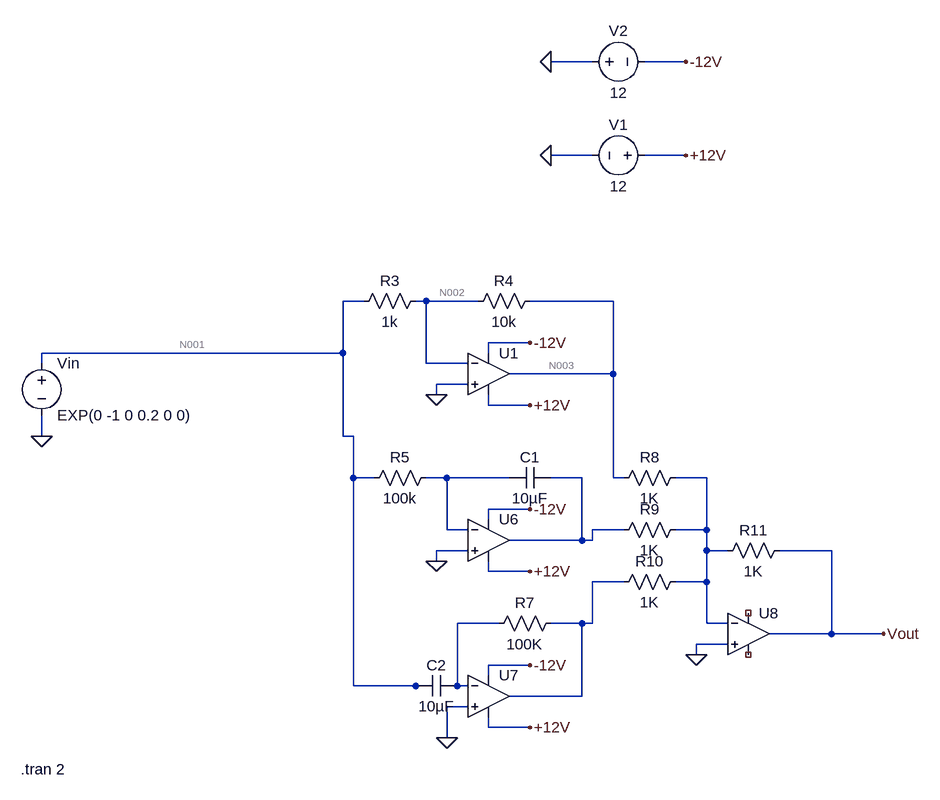
[diagram p0: schematic Draft6.asc]
Draft6.asc, the LTspice schematic file:
Version 4
SHEET 1 1112 704
WIRE 592 -400 528 -400
WIRE 736 -400 672 -400
WIRE 592 -256 528 -256
WIRE 736 -256 672 -256
WIRE 240 -32 208 -32
WIRE 336 -32 320 -32
WIRE 416 -32 336 -32
WIRE 624 -32 496 -32
WIRE 496 32 432 32
WIRE 208 48 208 -32
WIRE 208 48 -256 48
WIRE 432 48 432 32
WIRE -256 64 -256 48
WIRE 336 64 336 -32
WIRE 400 64 336 64
WIRE 624 80 624 -32
WIRE 624 80 464 80
WIRE 400 96 352 96
WIRE 352 112 352 96
WIRE 432 128 432 112
WIRE 496 128 432 128
WIRE -256 176 -256 144
WIRE 208 176 208 48
WIRE 224 176 208 176
WIRE 224 240 224 176
WIRE 256 240 224 240
WIRE 368 240 336 240
WIRE 464 240 368 240
WIRE 576 240 528 240
WIRE 624 240 624 80
WIRE 640 240 624 240
WIRE 768 240 720 240
WIRE 496 288 432 288
WIRE 432 304 432 288
WIRE 368 320 368 240
WIRE 400 320 368 320
WIRE 640 320 592 320
WIRE 768 320 768 240
WIRE 768 320 720 320
WIRE 576 336 576 240
WIRE 576 336 464 336
WIRE 592 336 592 320
WIRE 592 336 576 336
WIRE 400 352 352 352
WIRE 768 352 768 320
WIRE 800 352 768 352
WIRE 960 352 880 352
WIRE 352 368 352 352
WIRE 432 384 432 368
WIRE 496 384 432 384
WIRE 640 400 592 400
WIRE 768 400 768 352
WIRE 768 400 720 400
WIRE 448 464 384 464
WIRE 576 464 528 464
WIRE 592 464 592 400
WIRE 592 464 576 464
WIRE 768 464 768 400
WIRE 800 464 768 464
WIRE 960 480 960 352
WIRE 960 480 864 480
WIRE 1040 480 960 480
WIRE 800 496 752 496
WIRE 752 512 752 496
WIRE 496 528 432 528
WIRE 432 544 432 528
WIRE 224 560 224 240
WIRE 320 560 224 560
WIRE 336 560 320 560
WIRE 384 560 384 464
WIRE 400 560 384 560
WIRE 576 576 576 464
WIRE 576 576 464 576
WIRE 400 592 368 592
WIRE 432 624 432 608
WIRE 496 624 432 624
WIRE 368 640 368 592
FLAG 528 -256 0
FLAG 736 -256 +12V
FLAG 496 128 +12V
FLAG 496 384 +12V
FLAG 496 624 +12V
FLAG 496 32 -12V
FLAG 496 288 -12V
FLAG 496 528 -12V
FLAG 528 -400 0
FLAG 736 -400 -12V
FLAG 752 512 0
FLAG 352 368 0
FLAG 352 112 0
FLAG 368 640 0
FLAG -256 176 0
FLAG 1040 480 Vout
SYMBOL voltage 688 -256 R90
WINDOW 0 -32 56 VBottom 2
WINDOW 3 32 56 VTop 2
WINDOW 123 0 0 Left 0
WINDOW 39 0 0 Left 0
SYMATTR InstName V1
SYMATTR Value 12
SYMBOL voltage 576 -400 R270
WINDOW 0 32 56 VTop 2
WINDOW 3 -32 56 VBottom 2
WINDOW 123 0 0 Left 0
WINDOW 39 0 0 Left 0
SYMATTR InstName V2
SYMATTR Value 12
SYMBOL res 336 -48 R90
WINDOW 0 0 56 VBottom 2
WINDOW 3 32 56 VTop 2
SYMATTR InstName R3
SYMATTR Value 1k
SYMBOL res 512 -48 R90
WINDOW 0 0 56 VBottom 2
WINDOW 3 32 56 VTop 2
SYMATTR InstName R4
SYMATTR Value 10k
SYMBOL res 352 224 R90
WINDOW 0 0 56 VBottom 2
WINDOW 3 32 56 VTop 2
SYMATTR InstName R5
SYMATTR Value 100k
SYMBOL cap 528 224 R90
WINDOW 0 0 32 VBottom 2
WINDOW 3 32 32 VTop 2
SYMATTR InstName C1
SYMATTR Value 10µF
SYMBOL cap 384 544 R90
WINDOW 0 0 32 VBottom 2
WINDOW 3 32 32 VTop 2
SYMATTR InstName C2
SYMATTR Value 10µF
SYMBOL res 544 448 R90
WINDOW 0 0 56 VBottom 2
WINDOW 3 32 56 VTop 2
SYMATTR InstName R7
SYMATTR Value 100K
SYMBOL res 896 336 R90
WINDOW 0 0 56 VBottom 2
WINDOW 3 32 56 VTop 2
SYMATTR InstName R11
SYMATTR Value 1K
SYMBOL res 736 224 R90
WINDOW 0 0 56 VBottom 2
WINDOW 3 32 56 VTop 2
SYMATTR InstName R8
SYMATTR Value 1K
SYMBOL res 736 304 R90
WINDOW 0 0 56 VBottom 2
WINDOW 3 32 56 VTop 2
SYMATTR InstName R9
SYMATTR Value 1K
SYMBOL res 736 384 R90
WINDOW 0 0 56 VBottom 2
WINDOW 3 32 56 VTop 2
SYMATTR InstName R10
SYMATTR Value 1K
SYMBOL voltage -256 48 R0
WINDOW 123 0 0 Left 0
WINDOW 39 0 0 Left 0
SYMATTR InstName Vin
SYMATTR Value EXP(0 -1 0 0.2 0 0)
SYMBOL OpAmps\\UniversalOpAmp2 432 80 R0
SYMATTR InstName U1
SYMBOL OpAmps\\UniversalOpAmp2 432 336 R0
SYMATTR InstName U6
SYMBOL OpAmps\\UniversalOpAmp2 432 576 R0
SYMATTR InstName U7
SYMBOL OpAmps\\UniversalOpAmp2 832 480 R0
SYMATTR InstName U8
TEXT -288 688 Left 2 !.tran 2

The netlist it stands for:
* Draft6.asc
V1 +12V 0 12
V2 0 -12V 12
R3 N002 N001 1k
R4 N003 N002 10k
R5 N004 N001 100k
C1 N005 N004 10µF
C2 N008 N001 10µF
R7 N007 N008 100K
R11 Vout N006 1K
R8 N006 N003 1K
R9 N006 N005 1K
R10 N006 N007 1K
Vin N001 0 EXP(0 -1 0 0.2 0 0)
XU1 0 N002 -12V +12V N003 level2 Avol=1Meg GBW=10Meg Slew=10Meg Ilimit=25m Rail=0 Vos=0 En=0 Enk=0 In=0 Ink=0 Rin=500Meg  ; pins In+ In- V+ V- OUT
XU6 0 N004 -12V +12V N005 level2 Avol=1Meg GBW=10Meg Slew=10Meg Ilimit=25m Rail=0 Vos=0 En=0 Enk=0 In=0 Ink=0 Rin=500Meg  ; pins In+ In- V+ V- OUT
XU7 0 N008 -12V +12V N007 level2 Avol=1Meg GBW=10Meg Slew=10Meg Ilimit=25m Rail=0 Vos=0 En=0 Enk=0 In=0 Ink=0 Rin=500Meg  ; pins In+ In- V+ V- OUT
XU8 0 N006 NC_01 NC_02 Vout level2 Avol=1Meg GBW=10Meg Slew=10Meg Ilimit=25m Rail=0 Vos=0 En=0 Enk=0 In=0 Ink=0 Rin=500Meg  ; pins In+ In- V+ V- OUT
.tran 2
.lib UniversalOpAmp2.lib
.backanno
.end

* Results of the author's LTspice run, read from the files saved beside the schematic
* Operating Point, zero values left out:
*   V(+12v) = 12 V
*   V(-12v) = -12 V
*   I(V1) = -21 A
*   I(V2) = -21 A
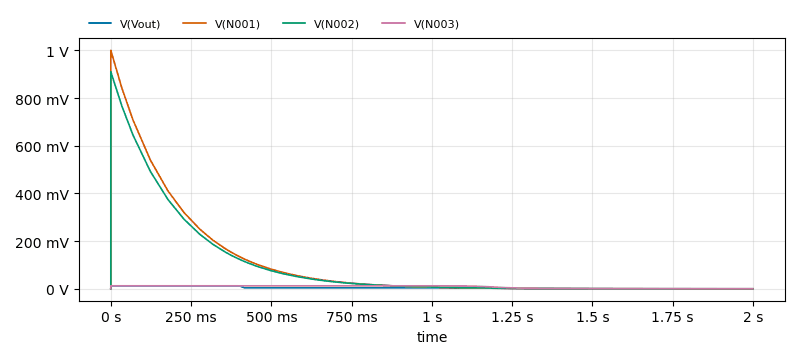
[diagram p1: Transient Analysis of Draft6.asc, plotted from the saved traces]
* Transient Analysis, 1 run:
*   V(Vout): min -46.08 nV, max 12.48 mV, average 4.271 mV, rms 6.182 mV, last 15.67 µV
*   V(N001): min -495.9 nV, max 1 V, average 100.4 mV, rms 225.4 mV, last 45.4 µV
*   V(N002): min -439.2 nV, max 910.4 mV, average 91.98 mV, rms 205.4 mV, last 46.06 µV
*   V(N003): min -66.15 nV, max 12.54 mV, average 7.771 mV, rms 9.594 mV, last 52.62 µV